# Altium schematic sheet 51_ADC.SchDoc
size A4; SheetNumber: 13; SheetTotal: 21
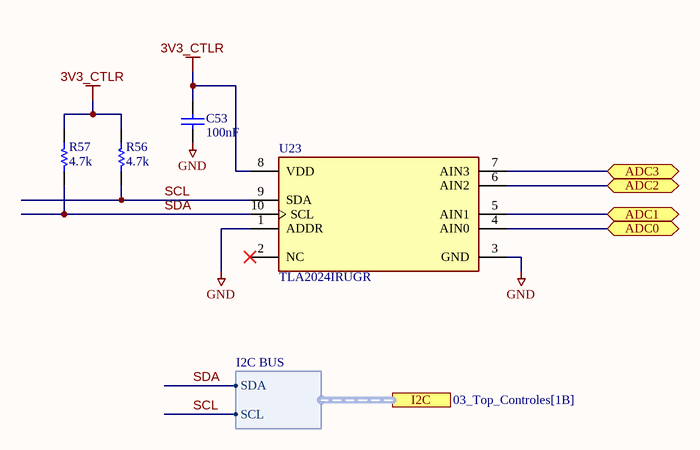
[diagram p0: 51_ADC.SchDoc]

## Parts
C53  100nF  [CAPC1005X55X25NL05T05]
R56  4.7k  [RESC1005X40X25ML05T10]
R57  4.7k  [RESC1005X40X25ML05T10]
U23  TLA2024IRUGR  [FP-RUG0010A-MFG]

## Ports
ADC0 (bidir), ADC1 (bidir), ADC2 (bidir), ADC3 (bidir), I2C (harness I2C BUS, see 03_Top_Controles[1B])

## Harnesses
I2C BUS: SDA, SCL

## Nets
3V3_CTLR: C53.2 R56.2 R57.2 U23.8(VDD)
GND: C53.1 U23.1(ADDR) U23.3(GND)
ADC0: U23.4(AIN0) ; port ADC0
ADC1: U23.5(AIN1) ; port ADC1
ADC2: U23.6(AIN2) ; port ADC2
ADC3: U23.7(AIN3) ; port ADC3
SCL: R56.1 U23.9(SDA) ; port I2C.SCL
SDA: R57.1 U23.10(SCL) ; port I2C.SDA

Not connected (* = marked no-connect by the designer): U23 2(NC)*

## Library data of the parts
C53 = CMP-2008-02030-1: Manufacturer: Vitramon; Part Number: VJ0402Y104KXJCW1BC
R56 R57 = CMP-2002-06456-1: Manufacturer: Panasonic; Part Number: ERJ-S02F4701X
U23 = CMP-04860-000013-1: IC ADC 12BIT SIGMA-DELTA 10X2QFN; Number of A/D Converters: 1; Interface: I2C; Number of Bits: 12; Sampling Rate: 3300S/s; Number of Inputs: 4; Mount: Surface Mount; Max Operating Temperature: 85°C; Min Operating Temperature: -40°C; RoHS Compliant: Yes; Packaging: Tape and Reel